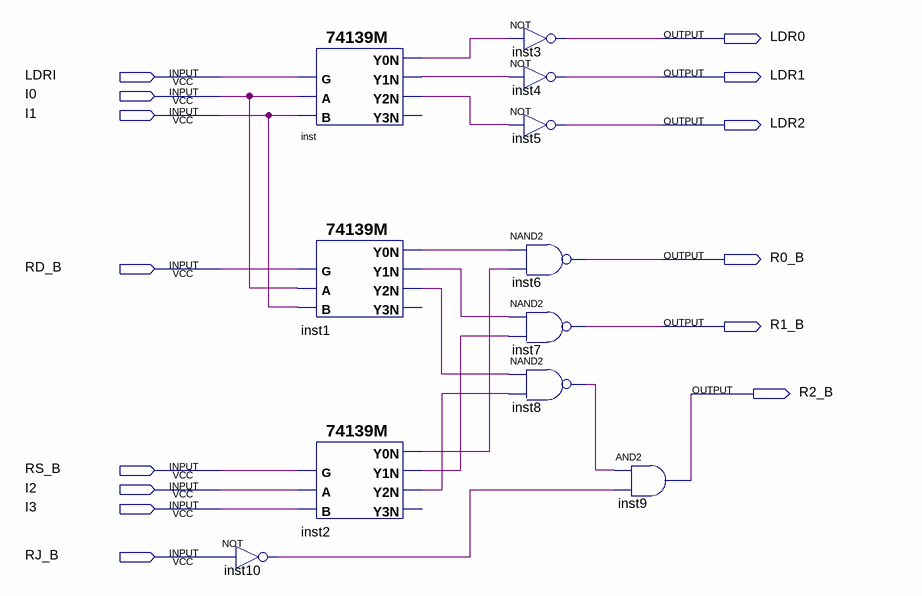
[diagram p0: schematic sheet]
// Quartus schematic LDR0_2.bdf as structural Verilog: 11 symbols, 14 pins
module LDR0_2 (
  input  LDRI,
  input  I0,
  input  I1,
  input  RD_B,
  input  RS_B,
  input  I2,
  input  I3,
  input  RJ_B,
  output LDR0,
  output LDR1,
  output LDR2,
  output R0_B,
  output R1_B,
  output R2_B
);

  wire inst1_y0n, inst1_y1n, inst1_y2n, inst2_y0n, inst2_y1n, inst2_y2n, inst8_out, inst10_out, inst_y0n,
       inst_y1n, inst_y2n;

  not inst10 (inst10_out, RJ_B);
  \74139M  inst (.B(I1), .A(I0), .G(LDRI), .Y2N(inst_y2n), .Y0N(inst_y0n), .Y1N(inst_y1n));  // open: Y3N
  \74139M  inst1 (.B(I1), .A(I0), .G(RD_B), .Y2N(inst1_y2n), .Y0N(inst1_y0n), .Y1N(inst1_y1n));  // open: Y3N
  \74139M  inst2 (.B(I3), .A(I2), .G(RS_B), .Y2N(inst2_y2n), .Y0N(inst2_y0n), .Y1N(inst2_y1n));  // open: Y3N
  not inst3 (LDR0, inst_y0n);
  not inst4 (LDR1, inst_y1n);
  not inst5 (LDR2, inst_y2n);
  nand inst6 (R0_B, inst1_y0n, inst2_y0n);
  nand inst7 (R1_B, inst1_y1n, inst2_y1n);
  nand inst8 (inst8_out, inst1_y2n, inst2_y2n);
  and inst9 (R2_B, inst8_out, inst10_out);
endmodule
